# Altium project PCB_Curso_Octubre.PrjPcb
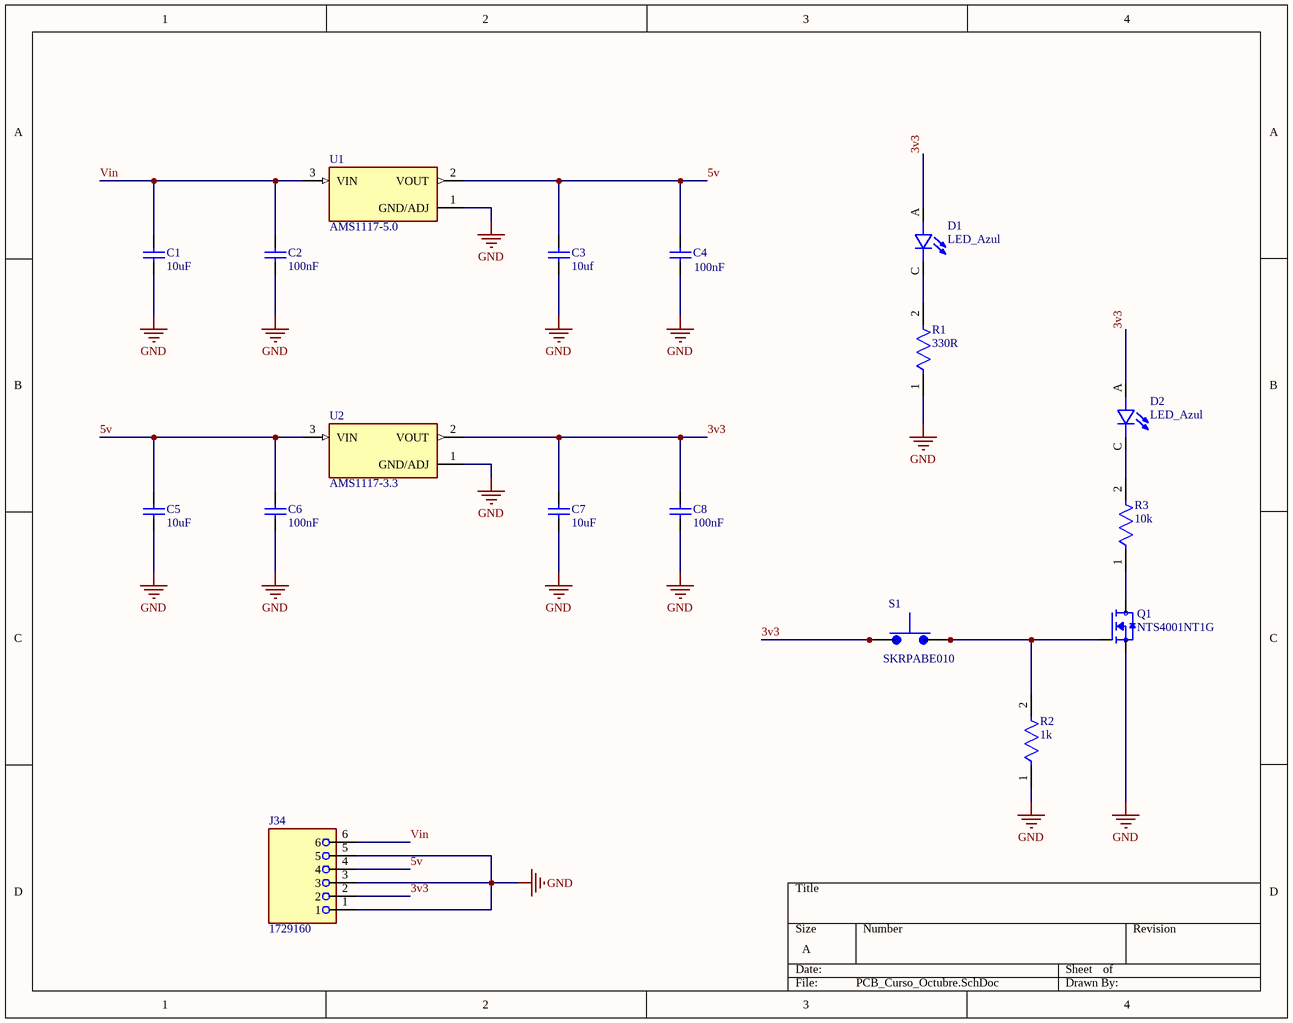
[diagram p0: PCB_Curso_Octubre.SchDoc]
1 sheet, 18 parts. Net scope: global (net labels, ports and power ports of the same name join across sheets).
Board file: PCB_Curso_Octubre.PcbDoc

## Sheet PCB_Curso_Octubre.SchDoc
size A; SheetNumber: 1; SheetTotal: 1

### Parts
C1  10uF  [CAPC2013X145X48ML20T23]
C2  100nF  [CAPC2013X145X48ML20T23]
C3  10uf  [CAPC2013X145X48ML20T23]
C4  100nF  [CAPC2013X145X48ML20T23]
C5  10uF  [CAPC2013X145X48ML20T23]
C6  100nF  [CAPC2013X145X48ML20T23]
C7  10uF  [CAPC2013X145X48ML20T23]
C8  100nF  [CAPC2013X145X48ML20T23]
D1  LED_Azul  [LEDC2012X120N]
D2  LED_Azul  [LEDC2012X120N]
J34  1729160  [PHOENIX_1729160]
Q1  NTS4001NT1G  [SOT65P220X100-3N]
R1  330R  [FP-MCU0805-IPC_B]
R2  1k  [FP-MCU0805-IPC_B]
R3  10k  [FP-MCU0805-IPC_B]
S1  SKRPABE010  [SW_SKRPABE010]
U1  AMS1117-5.0  [SOT229P700X180-4N]
U2  AMS1117-3.3  [SOT229P700X180-4N]

### Nets
GND: C1.2 C2.2 C3.2 C4.2 C5.2 C6.2 C7.2 C8.2 J34.1 J34.3 J34.5 Q1.2(S) R1.1 R2.1 U1.1(GND/ADJ) U2.1(GND/ADJ)
3v3: C7.1 C8.1 D1.A D2.A J34.2 S1.1 S1.2 U2.2(VOUT)
5v: C3.1 C4.1 C5.1 C6.1 J34.4 U1.2(VOUT) U2.3(VIN)
Vin: C1.1 C2.1 J34.6 U1.3(VIN)
NetD1_C: D1.C R1.2
NetD2_C: D2.C R3.2
NetQ1_1: Q1.1(G) R2.2 S1.3 S1.4
NetQ1_3: Q1.3(D) R3.1

### Library data of the parts
C1-C8 = CMP-2007-03205-1: Manufacturer: Vitramon; Part Number: VJ0805Y682KXAMT
D1 D2 = SML-LXT0805IW-TR: LED;Red;11mcd;0.061In.Dia.;SMD;100mA;2V Vf;635nm;140deg;SMD;White Diffused;5V Vr | Lumex SML-LXT0805IW-TR; MF: Lumex Opto/Components; SnapEDA_Link: https://www.snapeda.com/parts/SML-LXT0805IW-TR/Lumex+Opto%252FComponents+Inc./view-part/?ref=snap; Package: 0805 Lumex; Value: *; MP: SML-LXT0805IW-TR; Check_prices: https://www.snapeda.com/parts/SML-LXT0805IW-TR/Lumex+Opto%252FComponents+Inc./view-part/?ref=eda
J34 = 1729160: PCB Terminal Screw 5.08mm 16AWG 400V 13.5A 6 Position COMBICON MKDSN Series | Phoenix Contact 1729160; SnapEDA_Link: https://www.snapeda.com/parts/1729160/Phoenix+Contact/view-part/?ref=snap; Package: None; Value: *; MF: Phoenix Contact; MP: 1729160; Check_prices: https://www.snapeda.com/parts/1729160/Phoenix+Contact/view-part/?ref=eda
Q1 = NTS4001NT1G: N-Channel 30V 270mA _Ta_ 330mW _Ta_ Surface Mount SC-70-3 _SOT323_; MF: ON Semiconductor; Package: SC-70 ON Semiconductor; MP: NTS4001NT1G; SnapEDA_Link: https://www.snapeda.com/parts/NTS4001NT1G/ON%20Semiconductor/view-part/274588/?ref=snap; Price: None; Value: *; Availability: Unavailable
R1-R3 = CMP-02407-001108-1: RES 1.05K OHM 0.5% 1/5W 0805; Voltage Rating: 150V; Temperature Coefficient: 25ppm/°C; Tolerance: 0.1%; Max Power Dissipation: 200mW; Resistance: 51.1kR; Case Code (Metric): 2012; Composition: Thin Film; Number of Terminations: 2; Termination: SMD/SMT; Min Operating Temperature: -55°C; Package Quantity: 1000; Packaging: Tape and Reel; Case Code (Imperial): 0805; Max Operating Temperature: 155°C; Length: 0.079inch; Width: 0.049inch; Weight: 0.000162oz; Height: 0.024inch; Features: Automotive AEC-Q200; Case/Package: 0805; Power Rating: 200mW
S1 = SKRPABE010: Switch Tactile N.O. SPST Button J-Bend 0.05A 16VDC 1.57N SMD Automotive T/R; MF: ALPS; SnapEDA_Link: https://www.snapeda.com/parts/SKRPABE010/ALPS/view-part/?ref=snap; Package: None; Value: *; MP: SKRPABE010; Check_prices: https://www.snapeda.com/parts/SKRPABE010/ALPS/view-part/?ref=eda
U1 U2 = AMS1117-5.0: 1A LOW DROPOUT VOLTAGE REGULATOR; MF: ams; MP: AMS1117-5.0; Package: SOT-223 Seeed Technology; SnapEDA_Link: https://www.snapeda.com/parts/AMS1117-5.0/ams/view-part/?ref=snap; Check_prices: https://www.snapeda.com/parts/AMS1117-5.0/ams/view-part/?ref=eda; Availability: Not in stock; Value: *; Price: None